# Altium schematic sheet mini360.SchDoc
size A4; SheetNumber: 4; SheetTotal: 4
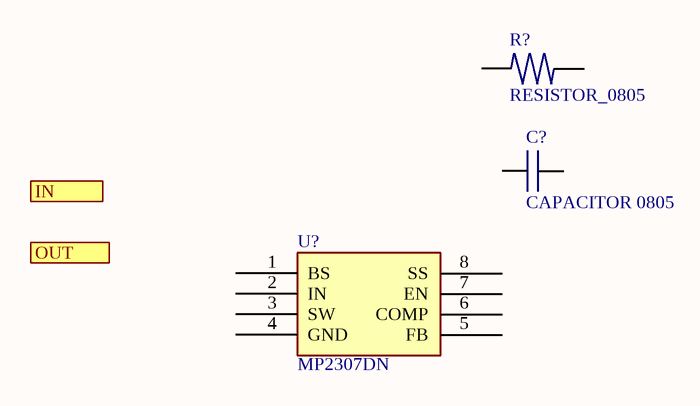
[diagram p0: mini360.SchDoc]

## Parts
C?  CAPACITOR 0805  [CAPACITOR 0805]
R?  RESISTOR_0805  [RESISTOR_0805]
U?  MP2307DN  [MP2307DN]

## Ports
IN, OUT

## Nets

Not connected (* = marked no-connect by the designer): C? 1 2; R? 1 2; U? 1(BS) 2(IN) 3(SW) 4(GND) 5(FB) 6(COMP) 7(EN) 8(SS)

## Library data of the parts
C? = CAPACITOR 0805: Generic Capacitor 0805, 2x1.25x1.4mm.
R? = RESISTOR_0805: Generic Resistor 0805.
U? = MP2307DN: IC BUCK STEP DOW 3A SOIC8N